# EAGLE schematic gnublin_ext_ssd1963 (EAGLE 6.3)
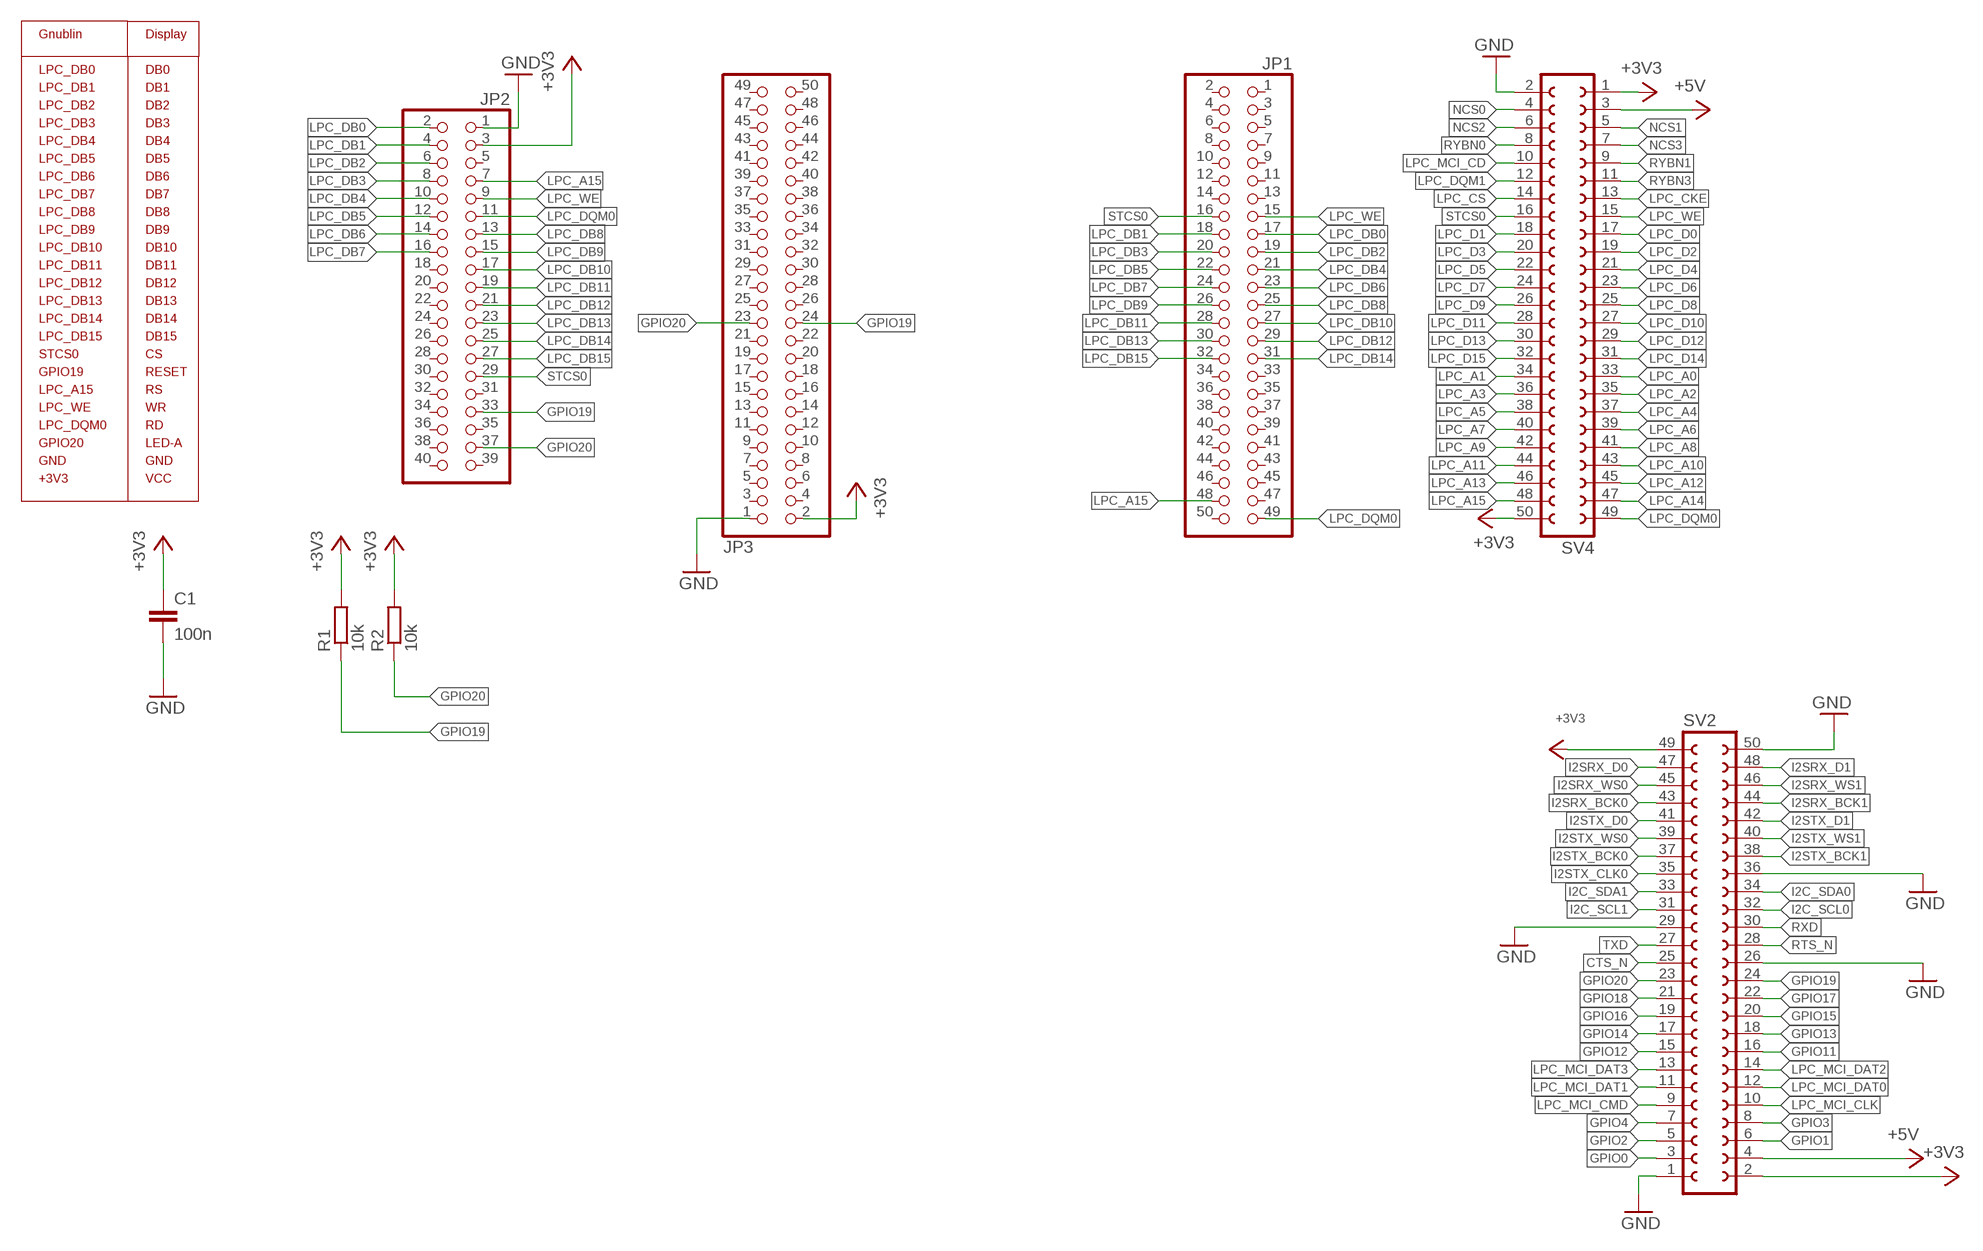
[diagram p0: schematic, sheet 1]

## Parts
C1  100n  C-EUC0805  [C0805]
JP1  PINHD-2X25_2.54-SMD  [2X25SMD]
JP2  PINHD-2X20  [2X20]
JP3  PINHD-2X25_2.54-SMD  [2X25SMD]
R1  10k  R-EU_R0603  [R0603]
R2  10k  R-EU_R0603  [R0603]
SV2  FE25-2  [FE25-2]
SV4  FE25-2  [FE25-2]

## Nets
+3V3: C1.1 JP2.3 JP3.2 R1.2 R2.2 SV2.2 SV2.49 SV4.1 SV4.50
+5V: SV2.4 SV4.3
CTS_N: SV2.25
GND: C1.2 JP2.1 JP3.1 SV2.1 SV2.26 SV2.29 SV2.36 SV2.50 SV4.2
GPIO0: SV2.3
GPIO1: SV2.6
GPIO2: SV2.5
GPIO3: SV2.8
GPIO4: SV2.7
GPIO11: SV2.16
GPIO12: SV2.15
GPIO13: SV2.18
GPIO14: SV2.17
GPIO15: SV2.20
GPIO16: SV2.19
GPIO17: SV2.22
GPIO18: SV2.21
GPIO19: JP2.33 JP3.24 R1.1 SV2.24
GPIO20: JP2.37 JP3.23 R2.1 SV2.23
I2C_SCL0: SV2.32
I2C_SCL1: SV2.31
I2C_SDA0: SV2.34
I2C_SDA1: SV2.33
I2SRX_BCK0: SV2.43
I2SRX_BCK1: SV2.44
I2SRX_D0: SV2.47
I2SRX_D1: SV2.48
I2SRX_WS0: SV2.45
I2SRX_WS1: SV2.46
I2STX_BCK0: SV2.37
I2STX_BCK1: SV2.38
I2STX_CLK0: SV2.35
I2STX_D0: SV2.41
I2STX_D1: SV2.42
I2STX_WS0: SV2.39
I2STX_WS1: SV2.40
LPC_A0: SV4.33
LPC_A1: SV4.34
LPC_A2: SV4.35
LPC_A3: SV4.36
LPC_A4: SV4.37
LPC_A5: SV4.38
LPC_A6: SV4.39
LPC_A7: SV4.40
LPC_A8: SV4.41
LPC_A9: SV4.42
LPC_A10: SV4.43
LPC_A11: SV4.44
LPC_A12: SV4.45
LPC_A13: SV4.46
LPC_A14: SV4.47
LPC_A15: JP1.48 JP2.7 SV4.48
LPC_CKE: SV4.13
LPC_CS: SV4.14
LPC_D0: SV4.17
LPC_D1: SV4.18
LPC_D2: SV4.19
LPC_D3: SV4.20
LPC_D4: SV4.21
LPC_D5: SV4.22
LPC_D6: SV4.23
LPC_D7: SV4.24
LPC_D8: SV4.25
LPC_D9: SV4.26
LPC_D10: SV4.27
LPC_D11: SV4.28
LPC_D12: SV4.29
LPC_D13: SV4.30
LPC_D14: SV4.31
LPC_D15: SV4.32
LPC_DB0: JP1.17 JP2.2
LPC_DB1: JP1.18 JP2.4
LPC_DB2: JP1.19 JP2.6
LPC_DB3: JP1.20 JP2.8
LPC_DB4: JP1.21 JP2.10
LPC_DB5: JP1.22 JP2.12
LPC_DB6: JP1.23 JP2.14
LPC_DB7: JP1.24 JP2.16
LPC_DB8: JP1.25 JP2.13
LPC_DB9: JP1.26 JP2.15
LPC_DB10: JP1.27 JP2.17
LPC_DB11: JP1.28 JP2.19
LPC_DB12: JP1.29 JP2.21
LPC_DB13: JP1.30 JP2.23
LPC_DB14: JP1.31 JP2.25
LPC_DB15: JP1.32 JP2.27
LPC_DQM0: JP1.49 JP2.11 SV4.49
LPC_DQM1: SV4.12
LPC_MCI_CD: SV4.10
LPC_MCI_CLK: SV2.10
LPC_MCI_CMD: SV2.9
LPC_MCI_DAT0: SV2.12
LPC_MCI_DAT1: SV2.11
LPC_MCI_DAT2: SV2.14
LPC_MCI_DAT3: SV2.13
LPC_WE: JP1.15 JP2.9 SV4.15
NCS0: SV4.4
NCS1: SV4.5
NCS2: SV4.6
NCS3: SV4.7
RTS_N: SV2.28
RXD: SV2.30
RYBN0: SV4.8
RYBN1: SV4.9
RYBN3: SV4.11
STCS0: JP1.16 JP2.29 SV4.16
TXD: SV2.27
Unconnected: JP1.1 JP1.2 JP1.3 JP1.4 JP1.5 JP1.6 JP1.7 JP1.8 JP1.9 JP1.10 JP1.11 JP1.12 JP1.13 JP1.14 JP1.33 JP1.34 JP1.35 JP1.36 JP1.37 JP1.38 JP1.39 JP1.40 JP1.41 JP1.42 JP1.43 JP1.44 JP1.45 JP1.46 JP1.47 JP1.50 JP2.5 JP2.18 JP2.20 JP2.22 JP2.24 JP2.26 JP2.28 JP2.30 JP2.31 JP2.32 JP2.34 JP2.35 JP2.36 JP2.38 JP2.39 JP2.40 JP3.3 JP3.4 JP3.5 JP3.6 JP3.7 JP3.8 JP3.9 JP3.10 JP3.11 JP3.12 JP3.13 JP3.14 JP3.15 JP3.16 JP3.17 JP3.18 JP3.19 JP3.20 JP3.21 JP3.22 JP3.25 JP3.26 JP3.27 JP3.28 JP3.29 JP3.30 JP3.31 JP3.32 JP3.33 JP3.34 JP3.35 JP3.36 JP3.37 JP3.38 JP3.39 JP3.40 JP3.41 JP3.42 JP3.43 JP3.44 JP3.45 JP3.46 JP3.47 JP3.48 JP3.49 JP3.50

## Notes on the sheet
- Gnublin | Display
- LPC_DB0 | DB0
- LPC_DB1 | DB1
- LPC_DB2 | DB2
- LPC_DB3 | DB3
- LPC_DB4 | DB4
- LPC_DB5 | DB5
- LPC_DB6 | DB6
- LPC_DB7 | DB7
- LPC_DB8 | DB8
- LPC_DB9 | DB9
- LPC_DB10 | DB10
- LPC_DB11 | DB11
- LPC_DB12 | DB12
- LPC_DB13 | DB13
- LPC_DB14 | DB14
- LPC_DB15 | DB15
- STCS0 | CS
- GPIO19 | RESET
- LPC_A15 | RS
- LPC_WE | WR
- LPC_DQM0 | RD
- GPIO20 | LED-A
- GND | GND
- +3V3 | VCC

## Library data of the parts
C1 = rcl:C-EU: CAPACITOR, European symbol
JP1 JP3 = pinhead_smd:PINHD-2X25: PIN HEADER
JP2 = pinhead:PINHD-2X20: PIN HEADER
R1 R2 = rcl:R-EU_: RESISTOR, European symbol
SV2 SV4 = con-lsta:FE25-2: FEMALE HEADER; OC_FARNELL: unknown; OC_NEWARK: unknown

## Net classes
0 default: width 0.254 mm, drill 0.7 mm, clearance 0.254 mm